# Altium schematic sheet POWER.SchDoc
size A4
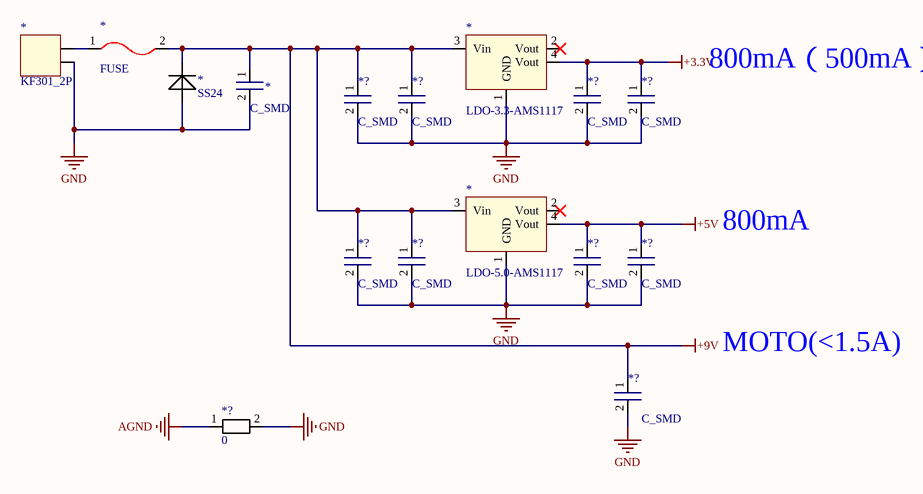
[diagram p0: POWER.SchDoc]

## Parts
(Parts that share a designator on the sheet are numbered #1, #2 ... from top to bottom, then left to right.)
*#1  KF301_2P  [KF301_2P]
*#2  FUSE  [Fuse_0805]
*#3  LDO-3.3-AMS1117  [SOT223_3]
*#4  SS24  [LC-SMA(DO-214AC)_S5]
*#5  C_SMD  [C_SOP_0603]
*#6  LDO-5.0-AMS1117  [SOT223_3]
*?#1  C_SMD  [C_SOP_0603]
*?#2  C_SMD  [C_SOP_0603]
*?#3  C_SMD  [C_SOP_0603]
*?#4  C_SMD  [C_SOP_0603]
*?#5  C_SMD  [C_SOP_0603]
*?#6  C_SMD  [C_SOP_0603]
*?#7  C_SMD  [C_SOP_0603]
*?#8  C_SMD  [C_SOP_0603]
*?#9  C_SMD  [C_SOP_0603]
*?#10  0  [R_SMD_0603]

## Nets
+3.3V: *#3.4(Vout) *?#3.1 *?#4.1
+5V: *#6.4(Vout) *?#7.1 *?#8.1
+9V: *#2.2(OUT) *#3.3(Vin) *#4.2 *#5.1 *#6.3(Vin) *?#1.1 *?#2.1 *?#5.1 *?#6.1 *?#9.1
AGND: *?#10.1
GND: *#1.2(GND) *#3.1(GND) *#4.1 *#5.2 *#6.1(GND) *?#1.2 *?#2.2 *?#3.2 *?#4.2 *?#5.2 *?#6.2 *?#7.2 *?#8.2 *?#9.2 *?#10.2
Net*#1_1: *#1.1(VCC) *#2.1(OUT)

Not connected (* = marked no-connect by the designer): *#3 2(Vout)*; *#6 2(Vout)*

## Notes on the sheet
- 800mA（500mA）
- 800mA
- MOTO(<1.5A)

## Library data of the parts
*#1 = 接线端子
*?#10 = R_SMD